# Altium schematic sheet leo_sch.SchDoc
size 400 x 309 mm; SheetNumber: 1; SheetTotal: 5
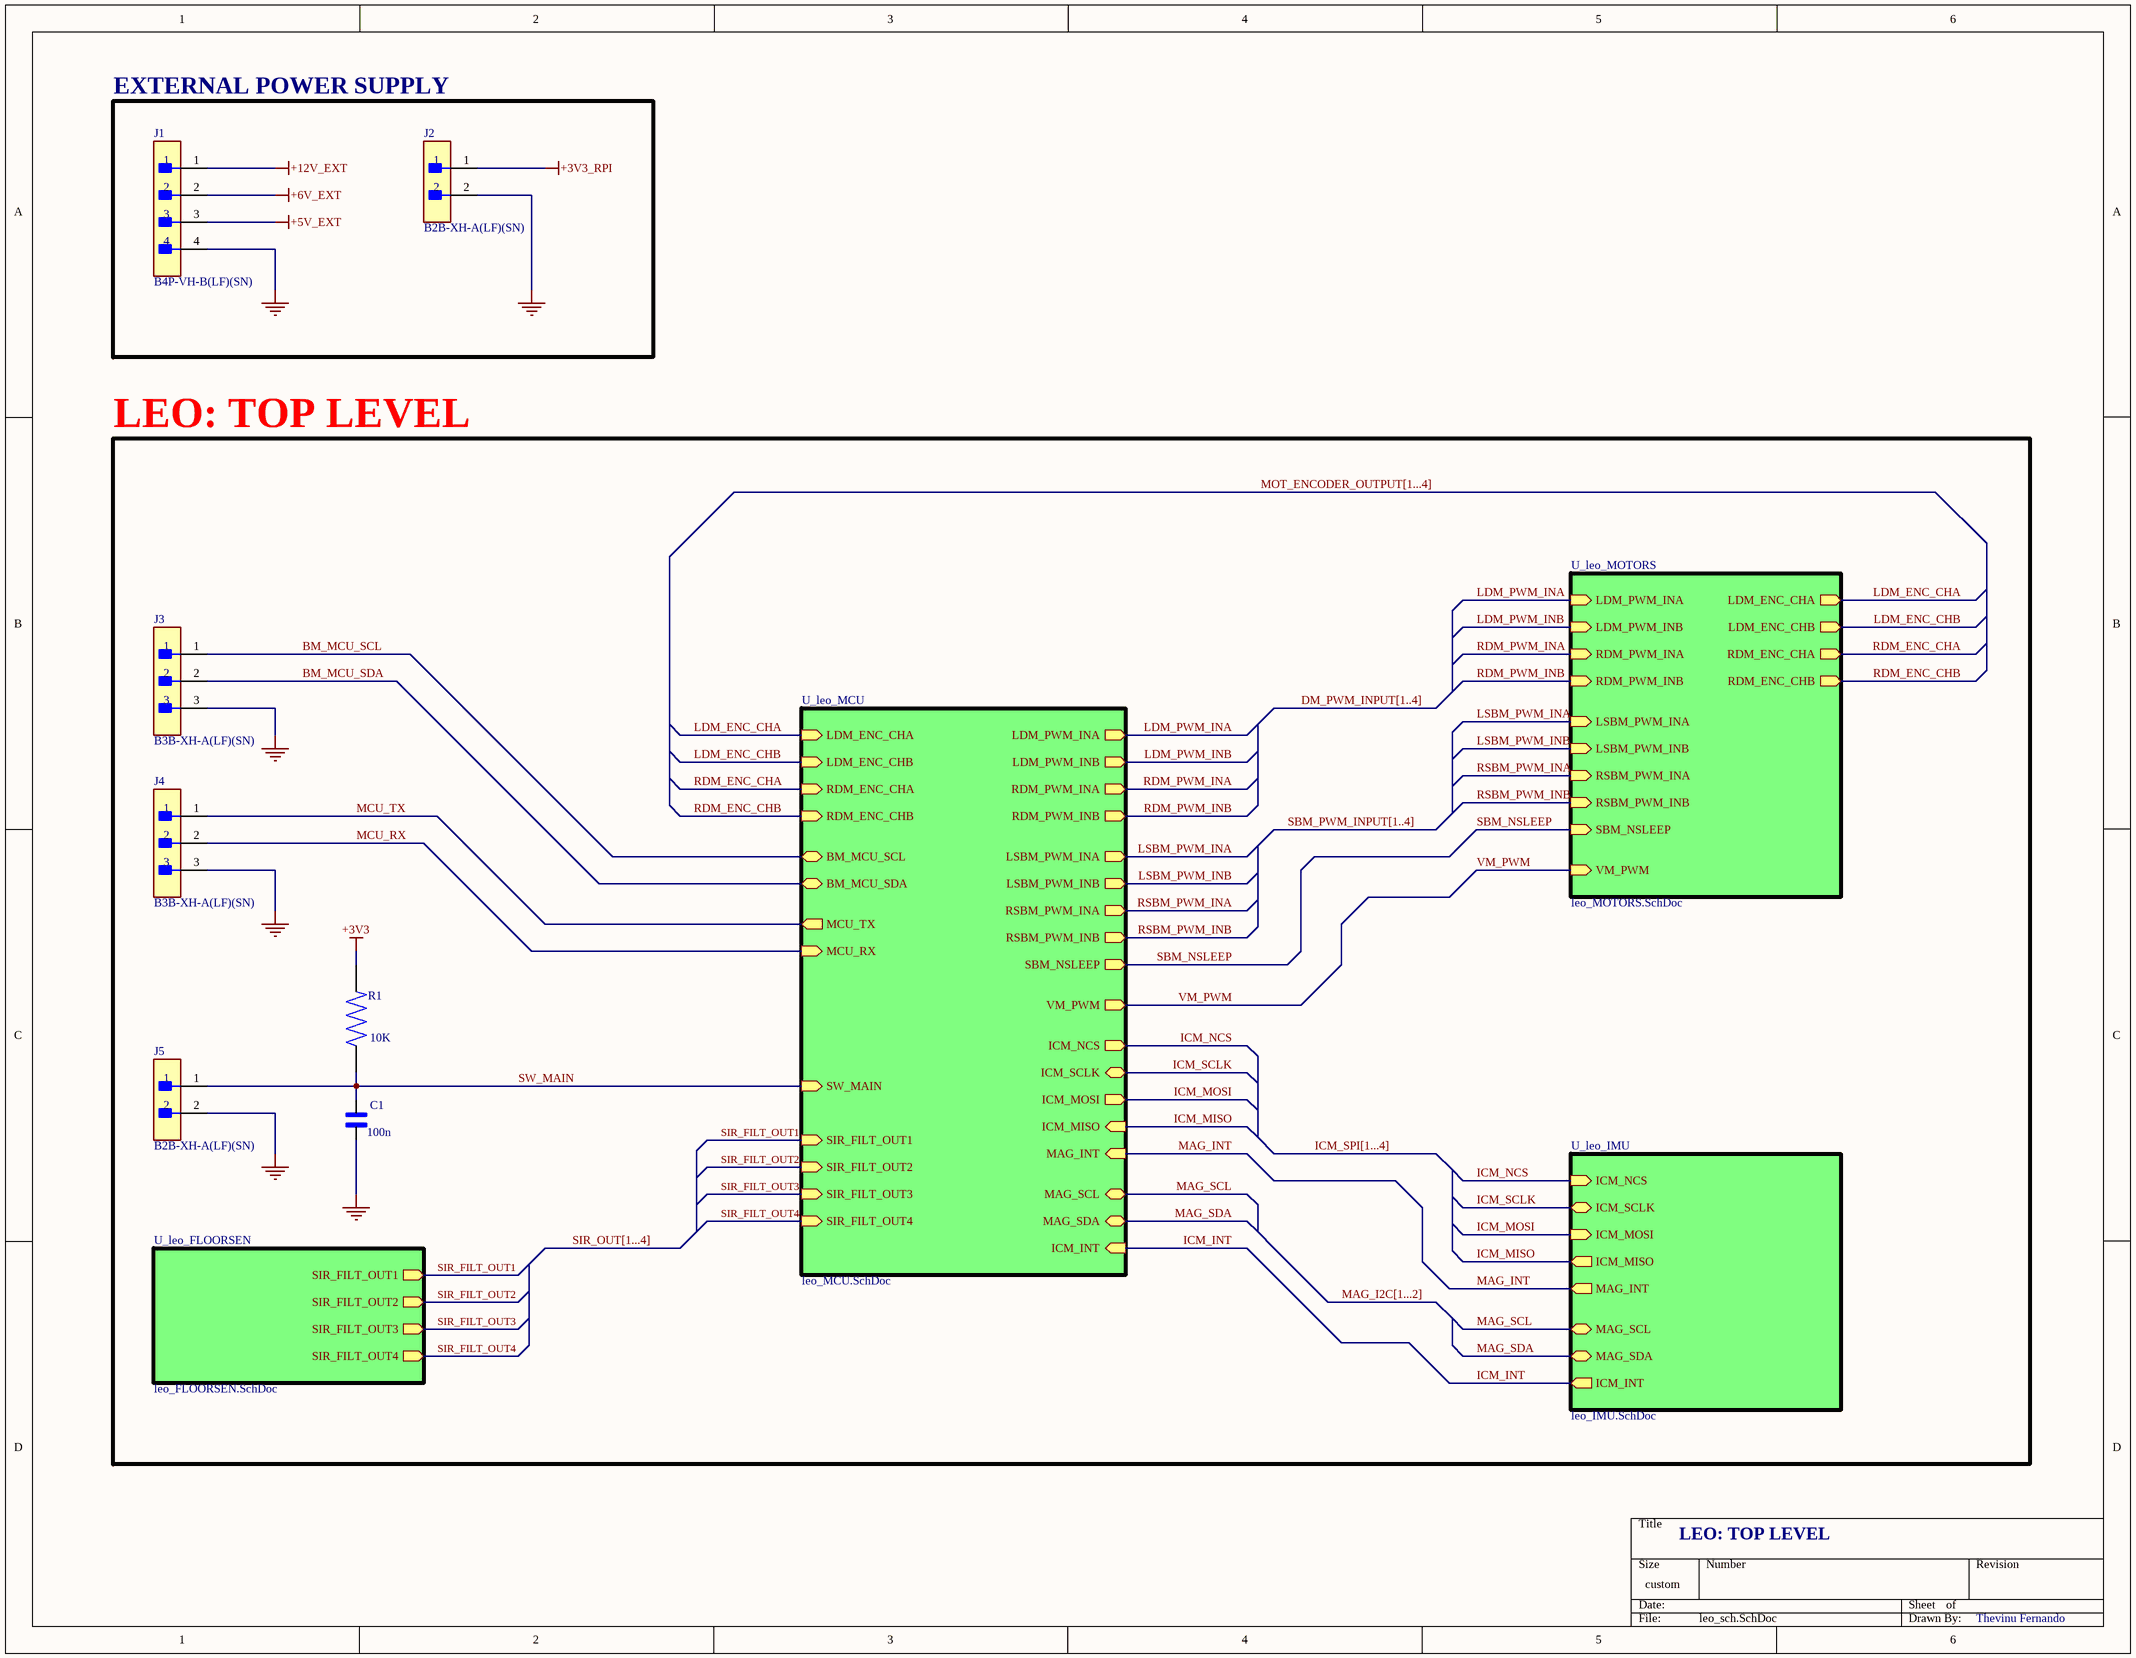
[diagram p0: leo_sch.SchDoc]

## Parts
C1  100n  [CAP_0402]
J1  B4P-VH-B(LF)(SN)  [FP-B4P-VH-B_LF_SN-MFG]
J2  B2B-XH-A(LF)(SN)  [FP-B2B-XH-A_LF_SN-MFG]
J3  B3B-XH-A(LF)(SN)  [FP-B3B-XH-A_LF_SN-MFG]
J4  B3B-XH-A(LF)(SN)  [FP-B3B-XH-A_LF_SN-MFG]
J5  B2B-XH-A(LF)(SN)  [FP-B2B-XH-A_LF_SN-MFG]
R1  10K  [RES_0402]

## Blocks framed on the sheet
EXTERNAL POWER SUPPLY: J1 J2
LEO: TOP LEVEL: C1 J3-J5 R1

## Sub-sheets
U_leo_FLOORSEN = leo_FLOORSEN.SchDoc: SIR_FILT_OUT1 (out), SIR_FILT_OUT2 (out), SIR_FILT_OUT3 (out), SIR_FILT_OUT4 (out)
U_leo_IMU = leo_IMU.SchDoc: ICM_INT (out), ICM_SCLK (bidir), ICM_MOSI (in), ICM_MISO (out), ICM_NCS (in), MAG_SCL (bidir), MAG_SDA (bidir), MAG_INT (out)
U_leo_MCU = leo_MCU.SchDoc: ICM_NCS (out), ICM_SCLK (bidir), ICM_MISO (in), ICM_MOSI (out), MAG_SCL (bidir), MAG_SDA (bidir), RDM_PWM_INA (out), RDM_PWM_INB (out), LDM_PWM_INA (out), LDM_PWM_INB (out), RDM_ENC_CHA (in), RDM_ENC_CHB (in), LDM_ENC_CHA (in), LDM_ENC_CHB (in), RSBM_PWM_INA (out), RSBM_PWM_INB (out), LSBM_PWM_INA (out), LSBM_PWM_INB (out), VM_PWM (out), SIR_FILT_OUT1 (in), SIR_FILT_OUT2 (in), SIR_FILT_OUT3 (in), SIR_FILT_OUT4 (in), BM_MCU_SCL (bidir), BM_MCU_SDA (bidir), MCU_TX (out), MCU_RX (in), SW_MAIN (in), SBM_NSLEEP (out), ICM_INT (in), MAG_INT (in)
U_leo_MOTORS = leo_MOTORS.SchDoc: LDM_ENC_CHB (out), LDM_ENC_CHA (out), RDM_ENC_CHB (out), RDM_ENC_CHA (out), LSBM_PWM_INA (in), LSBM_PWM_INB (in), RSBM_PWM_INA (in), RSBM_PWM_INB (in), SBM_NSLEEP (in), VM_PWM (in), LDM_PWM_INA (in), LDM_PWM_INB (in), RDM_PWM_INA (in), RDM_PWM_INB (in)

## Nets
+3V3: R1.2
+3V3_RPI: J2.1
+5V_EXT: J1.3
+6V_EXT: J1.2
+12V_EXT: J1.1
GND: C1.1 J1.4 J2.2 J3.3 J4.3 J5.2
BM_MCU_SCL: J3.1 ; sheet U_leo_MCU/BM_MCU_SCL
BM_MCU_SDA: J3.2 ; sheet U_leo_MCU/BM_MCU_SDA
ICM_INT: sheet U_leo_MCU/ICM_INT, sheet U_leo_IMU/ICM_INT
ICM_MISO: sheet U_leo_MCU/ICM_MISO, sheet U_leo_IMU/ICM_MISO
ICM_MOSI: sheet U_leo_MCU/ICM_MOSI, sheet U_leo_IMU/ICM_MOSI
ICM_NCS: sheet U_leo_MCU/ICM_NCS, sheet U_leo_IMU/ICM_NCS
ICM_SCLK: sheet U_leo_MCU/ICM_SCLK, sheet U_leo_IMU/ICM_SCLK
LDM_ENC_CHA: sheet U_leo_MCU/LDM_ENC_CHA, sheet U_leo_MOTORS/LDM_ENC_CHA
LDM_ENC_CHB: sheet U_leo_MCU/LDM_ENC_CHB, sheet U_leo_MOTORS/LDM_ENC_CHB
LDM_PWM_INA: sheet U_leo_MCU/LDM_PWM_INA, sheet U_leo_MOTORS/LDM_PWM_INA
LDM_PWM_INB: sheet U_leo_MCU/LDM_PWM_INB, sheet U_leo_MOTORS/LDM_PWM_INB
LSBM_PWM_INA: sheet U_leo_MCU/LSBM_PWM_INA, sheet U_leo_MOTORS/LSBM_PWM_INA
LSBM_PWM_INB: sheet U_leo_MCU/LSBM_PWM_INB, sheet U_leo_MOTORS/LSBM_PWM_INB
MAG_INT: sheet U_leo_MCU/MAG_INT, sheet U_leo_IMU/MAG_INT
MAG_SCL: sheet U_leo_MCU/MAG_SCL, sheet U_leo_IMU/MAG_SCL
MAG_SDA: sheet U_leo_MCU/MAG_SDA, sheet U_leo_IMU/MAG_SDA
MCU_RX: J4.2 ; sheet U_leo_MCU/MCU_RX
MCU_TX: J4.1 ; sheet U_leo_MCU/MCU_TX
RDM_ENC_CHA: sheet U_leo_MCU/RDM_ENC_CHA, sheet U_leo_MOTORS/RDM_ENC_CHA
RDM_ENC_CHB: sheet U_leo_MCU/RDM_ENC_CHB, sheet U_leo_MOTORS/RDM_ENC_CHB
RDM_PWM_INA: sheet U_leo_MCU/RDM_PWM_INA, sheet U_leo_MOTORS/RDM_PWM_INA
RDM_PWM_INB: sheet U_leo_MCU/RDM_PWM_INB, sheet U_leo_MOTORS/RDM_PWM_INB
RSBM_PWM_INA: sheet U_leo_MCU/RSBM_PWM_INA, sheet U_leo_MOTORS/RSBM_PWM_INA
RSBM_PWM_INB: sheet U_leo_MCU/RSBM_PWM_INB, sheet U_leo_MOTORS/RSBM_PWM_INB
SBM_NSLEEP: sheet U_leo_MCU/SBM_NSLEEP, sheet U_leo_MOTORS/SBM_NSLEEP
SIR_FILT_OUT1: sheet U_leo_MCU/SIR_FILT_OUT1, sheet U_leo_FLOORSEN/SIR_FILT_OUT1
SIR_FILT_OUT2: sheet U_leo_MCU/SIR_FILT_OUT2, sheet U_leo_FLOORSEN/SIR_FILT_OUT2
SIR_FILT_OUT3: sheet U_leo_MCU/SIR_FILT_OUT3, sheet U_leo_FLOORSEN/SIR_FILT_OUT3
SIR_FILT_OUT4: sheet U_leo_MCU/SIR_FILT_OUT4, sheet U_leo_FLOORSEN/SIR_FILT_OUT4
SW_MAIN: C1.2 J5.1 R1.1 ; sheet U_leo_MCU/SW_MAIN
VM_PWM: sheet U_leo_MCU/VM_PWM, sheet U_leo_MOTORS/VM_PWM

## Buses and harness runs
bus DM_PWM_INPUT[1..4]
bus ICM_SPI[1...4]
bus MAG_I2C[1...2]
bus MOT_ENCODER_OUTPUT[1...4]
bus SBM_PWM_INPUT[1..4]
bus SIR_OUT[1...4]

## Notes on the sheet
- LEO: TOP LEVEL
- Thevinu Fernando

## Library data of the parts
C1 = CAP_0402: Ceramic Capacitor X7R 0402 (1005 Metric); MF: Samsung; MP: CL05B104KO5NNNC; SnapEDA_Link: https://www.snapeda.com/parts/CL05B104KO5NNNC/Samsung/view-part/?ref=snap; Package: SMD-2 Samsung; Value: *; Check_prices: https://www.snapeda.com/parts/CL05B104KO5NNNC/Samsung/view-part/?ref=eda
J1 = B4P-VH-B(LF)(SN): CONN HEADER VERT 4POS 3.96MM; Number of Positions: 4; Voltage Rating: 250V; Pitch: 3.96mm; Flammability Rating: UL94 V-0; Contact Material: Brass; Insulation Color: Natural; Contact Shape: Square; Contact Finish - Mating: TIN; Termination: Solder; Number of Rows: 1; Mount: Through Hole; Fastening Type: Ramp; Packaging: Bulk; Insulation Material: PBT; Series: VH; Lead Free: Lead Free; Connector Type: Header; Contact Type: Male Pin
J2 J5 = B2B-XH-A(LF)(SN): CONN HEADER VERT 2POS 2.5MM; Current Rating: 3A; Voltage Rating: 250V; Number of Contacts: 2; Contact Resistance: 20mR; Wire/Cable Gauge: 22AWG; Insulation Resistance: 1GR; Connector Type: Male Pin; Packaging: Bulk; Contact Material: Brass; Lead Free: Lead Free; Orientation: Straight; Contact Plating: Tin; Max Current Rating: 3A; Termination: Solder; Fastening Type: Detent; Depth: 5.75mm; Housing Material: Polyamide; REACH SVHC: No SVHC; Series: XH; Voltage Rating (AC): 250V; Number of Positions: 2; Color: Natural; Contact Type: Male Pin; Max Voltage Rating (DC): 250V; Pitch: 2.5mm; Lead Pitch: 2.5mm; Mount: Through Hole; Max Operating Temperature: 85°C; Length: 7.4mm; Max Voltage Rating (AC): 250V; Min Operating Temperature: -25°C; Number of Rows: 1; Housing Color: White
J3 J4 = B3B-XH-A(LF)(SN): CONN HEADER VERT 3POS 2.5MM; Max Voltage Rating (DC): 250V; Number of Positions: 3; Current Rating: 3A; Gender: Male; Wire/Cable Gauge: 22AWG; Contact Resistance: 20mR; Insulation Resistance: 1GR; Insulation Material: Nylon; Contact Plating: Tin; Depth: 5.75mm; Contact Type: Male Pin; Max Operating Temperature: 85°C; Insulation Color: Natural; Voltage Rating (AC): 250V; Color: Natural; Connector Type: Header; Orientation: Straight; Fastening Type: Detent; Housing Color: White; Min Operating Temperature: -25°C; Termination: Solder; Voltage Rating: 250V; Series: XH; Pitch: 2.5mm; Contact Shape: Square; Number of Rows: 1; Lead Free: Lead Free; Packaging: Bulk; Mount: Through Hole; Flammability Rating: UL94 V-0; Max Voltage Rating (AC): 250V; REACH SVHC: No SVHC; Housing Material: Polyamide; Contact Material: Brass; Lead Pitch: 2.5mm; Contact Finish - Mating: TIN; Length: 9.9mm; Max Current Rating: 3A; Number of Contacts: 3
R1 = RES_0402: Chip Resistor 0402 (1005 Metric) Automotive AEC-Q200 Thick Film; MF: Panasonic; MP: ERJ-2RKF1002X; Package: 1005-2 Panasonic; Price: None; Check_prices: https://www.snapeda.com/parts/ERJ-2RKF1002X/Panasonic%20Electronic%20Components/view-part/78636/?ref=eda; Value: *; SnapEDA_Link: https://www.snapeda.com/parts/ERJ-2RKF1002X/Panasonic%20Electronic%20Components/view-part/78636/?ref=snap; Availability: In Stock